# EAGLE schematic SatNOGSBoard (EAGLE 6.5.0)
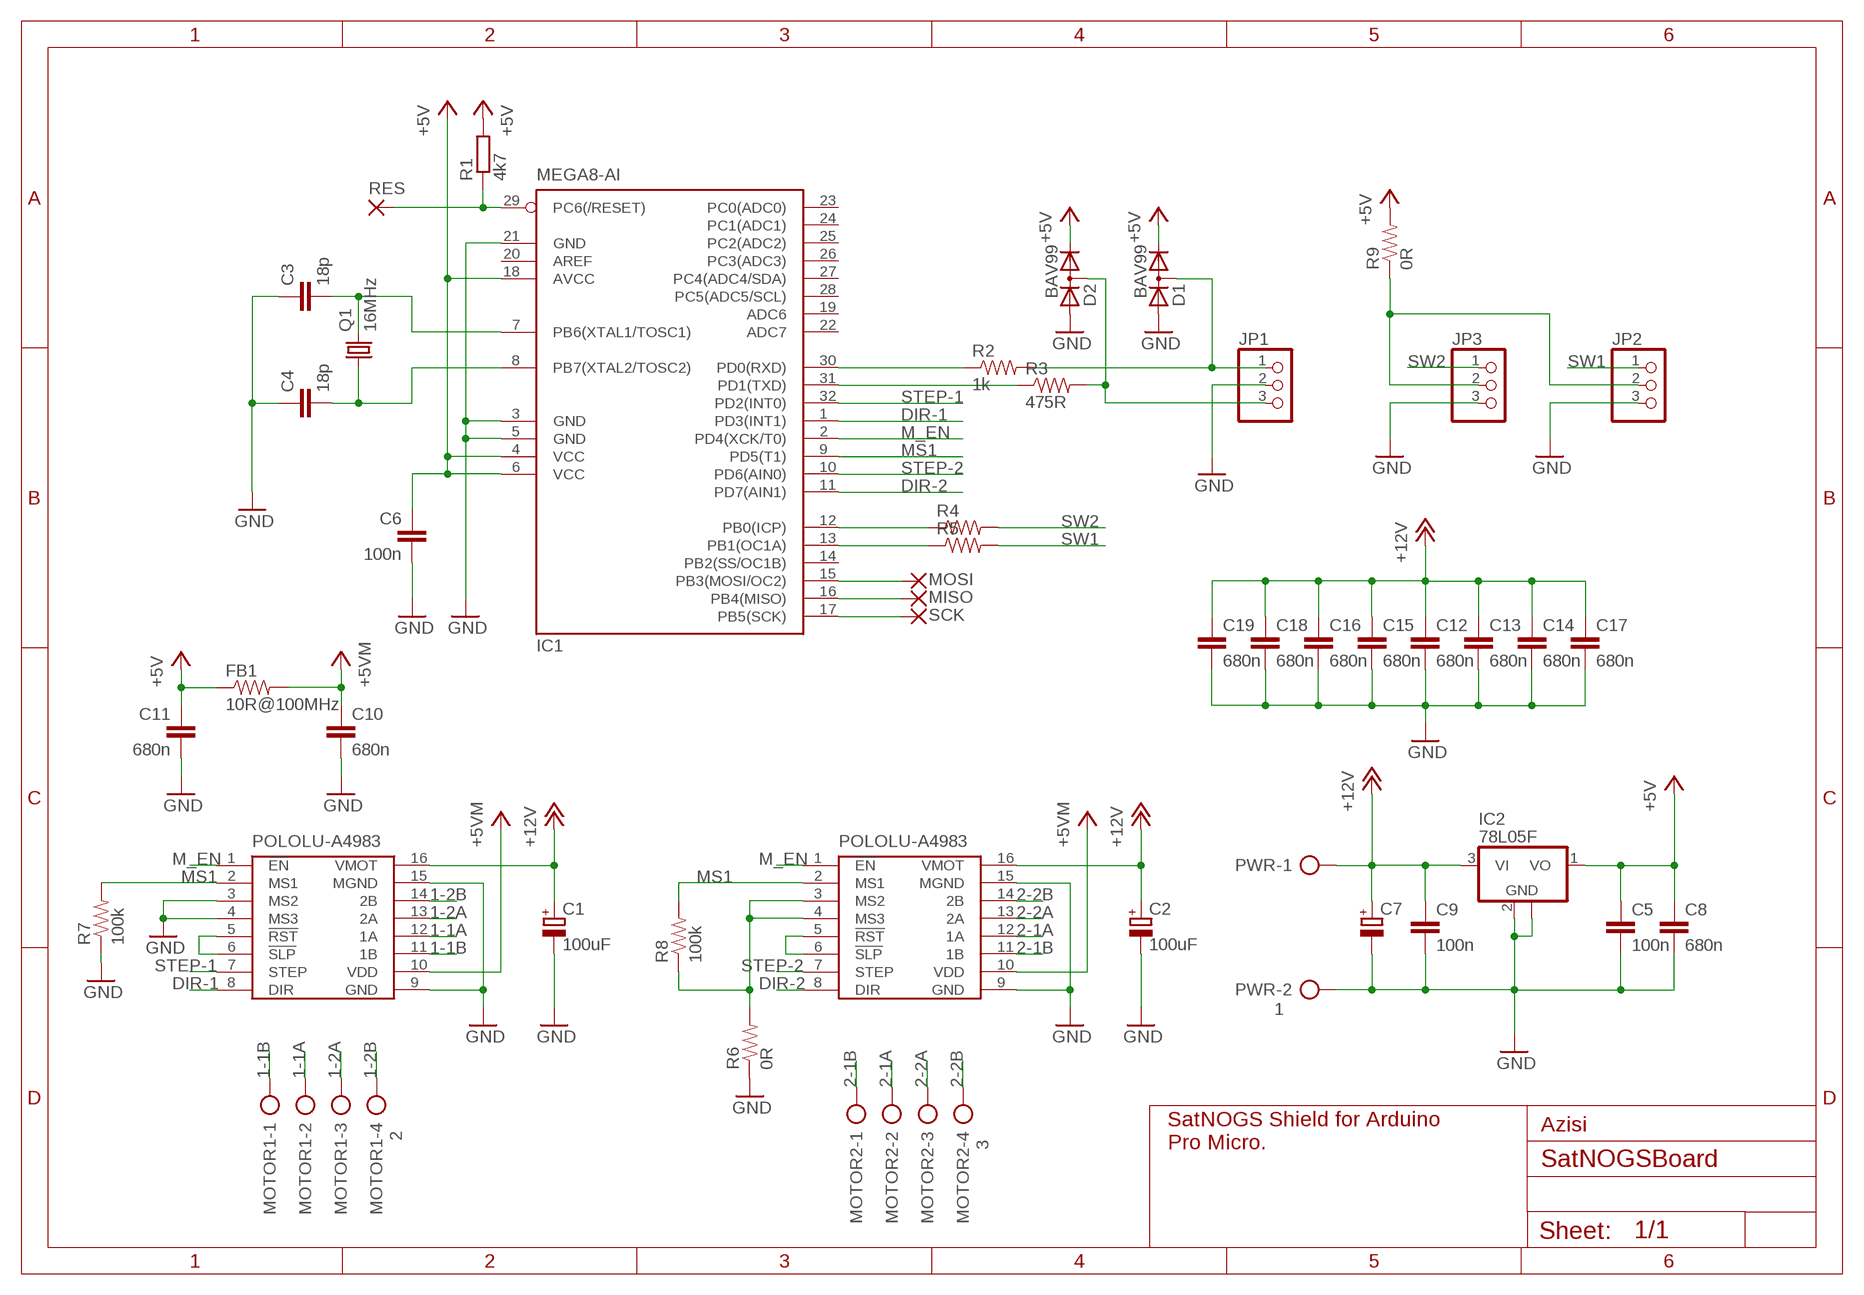
[diagram p0: schematic, sheet 1]

## Parts
C1  100uF  CPOL-EUE2.5-6  [E2,5-6]
C2  100uF  CPOL-EUE2.5-6  [E2,5-6]
C3  18p  C-EUC1206  [C1206]
C4  18p  C-EUC1206  [C1206]
C5  100n  C-EUC0805  [C0805]
C6  100n  C-EUC0603  [C0603]
C7  CPOL-EUC/6032-28R  [C/6032-28R]
C8  680n  C-EUC1206  [C1206]
C9  100n  C-EUC0805  [C0805]
C10  680n  C-EUC1206  [C1206]
C11  680n  C-EUC1206  [C1206]
C12  680n  C-EUC1206  [C1206]
C13  680n  C-EUC1206  [C1206]
C14  680n  C-EUC1206  [C1206]
C15  680n  C-EUC1206  [C1206]
C16  680n  C-EUC1206  [C1206]
C17  680n  C-EUC1206  [C1206]
C18  680n  C-EUC1206  [C1206]
C19  680n  C-EUC1206  [C1206]
D1  BAV99  BAV199  [SOT23]
D2  BAV99  BAV199  [SOT23]
DRIVER1  POLOLU-A4983POLOLU-A4983  [POLOLU-A4983]
DRIVER2  POLOLU-A4983POLOLU-A4983  [POLOLU-A4983]
FB1  10R@100MHz  RESISTOR0805-RES  [0805]
IC1  MEGA8-AI  [TQFP32-08]
IC2  78L05F  [SOT89]
JP1  PINHD-1X3  [1X03]
JP2  PINHD-1X3  [1X03]
JP3  PINHD-1X3  [1X03]
MISO  SMD2  [SMD1,27-2,54]
MOSI  SMD2  [SMD1,27-2,54]
MOTOR1  2  AK500/4  [AK500/4]
MOTOR2  3  AK500/4  [AK500/4]
PWR  1  AK500/2  [AK500/2]
Q1  16MHz  CSM-7X-DU  [CSM-7X-DU]
R1  4k7  R-EU_R0805  [R0805]
R2  1k  RESISTOR0805-RES  [0805]
R3  475R  RESISTOR0805-RES  [0805]
R4  RESISTOR0603-RES  [0603-RES]
R5  RESISTOR0603-RES  [0603-RES]
R6  0R  RESISTOR1206  [1206]
R7  100k  RESISTOR0805-RES  [0805]
R8  100k  RESISTOR0805-RES  [0805]
R9  0R  RESISTOR1206  [1206]
RES  SMD2  [SMD1,27-2,54]
SCK  SMD2  [SMD1,27-2,54]

## Nets
1-1A: DRIVER1.12(1A) MOTOR1.2
1-1B: DRIVER1.11(1B) MOTOR1.1
1-2A: DRIVER1.13(2A) MOTOR1.3
1-2B: DRIVER1.14(2B) MOTOR1.4
2-1A: DRIVER2.12(1A) MOTOR2.2
2-1B: DRIVER2.11(1B) MOTOR2.1
2-2A: DRIVER2.13(2A) MOTOR2.3
2-2B: DRIVER2.14(2B) MOTOR2.4
+5V: C5.1 C6.1 C8.1 C11.1 D1.2(C) D2.2(C) FB1.1 IC1.4(VCC) IC1.6(VCC) IC1.18(AVCC) IC2.1(VO) R1.2 R9.2
+5VM: C10.1 DRIVER1.10(VDD) DRIVER2.10(VDD) FB1.2
+12V: C1.+ C2.+ C7.+ C9.1 C12.1 C13.1 C14.1 C15.1 C16.1 C17.1 C18.1 C19.1 DRIVER1.16(VMOT) DRIVER2.16(VMOT) IC2.3(VI) PWR.1
DIR-1: DRIVER1.8(DIR) IC1.1(PD3(INT1))
DIR-2: DRIVER2.8(DIR) IC1.11(PD7(AIN1))
GND: C1.- C2.- C3.1 C4.1 C5.2 C6.2 C7.- C8.2 C9.2 C10.2 C11.2 C12.2 C13.2 C14.2 C15.2 C16.2 C17.2 C18.2 C19.2 D1.1(A) D2.1(A) DRIVER1.3(MS2) DRIVER1.4(MS3) DRIVER1.9(GND) DRIVER1.15(MGND) DRIVER2.9(GND) DRIVER2.15(MGND) IC1.3(GND) IC1.5(GND) IC1.21(GND) IC2.2(GND) IC2.2@1(GND) JP1.2 JP2.3 JP3.3 PWR.2 R6.1 R7.1
M_EN: DRIVER1.1(!EN) DRIVER2.1(!EN) IC1.2(PD4(XCK/T0))
MS1: DRIVER1.2(MS1) DRIVER2.2(MS1) IC1.9(PD5(T1)) R7.2 R8.2
N$1: DRIVER1.5(!RST) DRIVER1.6(!SLP)
N$2: DRIVER2.5(!RST) DRIVER2.6(!SLP)
N$3: D1.3(AC) JP1.1 R2.2
N$4: D2.3(AC) JP1.3 R3.2
N$5: IC1.29(PC6(/RESET)) R1.1 RES.1(P)
N$6: IC1.30(PD0(RXD)) R2.1
N$7: IC1.31(PD1(TXD)) R3.1
N$8: IC1.13(PB1(OC1A)) R5.1
N$9: IC1.15(PB3(MOSI/OC2)) MOSI.1(P)
N$10: IC1.16(PB4(MISO)) MISO.1(P)
N$11: IC1.17(PB5(SCK)) SCK.1(P)
N$12: IC1.12(PB0(ICP)) R4.1
N$13: DRIVER2.3(MS2) DRIVER2.4(MS3) R6.2 R8.1
N$14: JP2.2 JP3.2 R9.1
STEP-1: DRIVER1.7(STEP) IC1.32(PD2(INT0))
STEP-2: DRIVER2.7(STEP) IC1.10(PD6(AIN0))
SW1: JP2.1 R5.2
SW2: JP3.1 R4.2
XTAL1: C3.2 IC1.7(PB6(XTAL1/TOSC1)) Q1.2
XTAL2: C4.2 IC1.8(PB7(XTAL2/TOSC2)) Q1.1
Unconnected: IC1.14(PB2(SS/OC1B)) IC1.19(ADC6) IC1.20(AREF) IC1.22(ADC7) IC1.23(PC0(ADC0)) IC1.24(PC1(ADC1)) IC1.25(PC2(ADC2)) IC1.26(PC3(ADC3)) IC1.27(PC4(ADC4/SDA)) IC1.28(PC5(ADC5/SCL))

## Notes on the sheet
- Azisi
- SatNOGS Shield for Arduino
  Pro Micro.

## Library data of the parts
C1 C2 C7 = rcl:CPOL-EU: POLARIZED CAPACITOR, European symbol
C3-C6 C8-C19 = rcl:C-EU: CAPACITOR, European symbol
D1 D2 = diode:BAV199: DIODE low-leakage double diode
DRIVER1 DRIVER2 = Pololu-A4983:POLOLU-A4983
FB1 R2-R9 = SparkFun-Resistors:RESISTOR: Resistor Basic schematic elements and footprints for 0603, 1206, and PTH resistors.
IC1 = atmel:MEGA8: MICROCONTROLLER 8 Kbytes FLASH, 1 kbytes SRAM, 512 bytes EEPROM, USART, 6-channel 10 bit ADC, 2-channel 8 bit ADC Pin compatible with Atmega48, ATMega88, ATMega168 Source: avr.lbr; MPN: ATMEGA8-16AU; OC_FARNELL: 9171371; OC_NEWARK: 73M8863
IC2 = linear:78L*: POSITOIV-VOLTAGE REGULATORS Output up to 100 mA Source: http://focus.ti.com/lit/ds/symlink/ua78l05.pdf
JP1-JP3 = pinhead:PINHD-1X3: PIN HEADER
MISO MOSI RES SCK = wirepad:SMD2: SMD PAD
MOTOR1 MOTOR2 = con-ptr500:AK500/4: CONNECTOR; OC_FARNELL: unknown; OC_NEWARK: unknown
PWR = con-ptr500:AK500/2: CONNECTOR; OC_FARNELL: unknown; OC_NEWARK: unknown
Q1 = crystal:CSM-7X-DU: SMD CRYSTAL Source: www.ecsxtal.com .. Crystal 3.6864MHz CSM_7X_DU.PDF; OC_FARNELL: unknown; OC_NEWARK: unknown
R1 = rcl:R-EU_: RESISTOR, European symbol